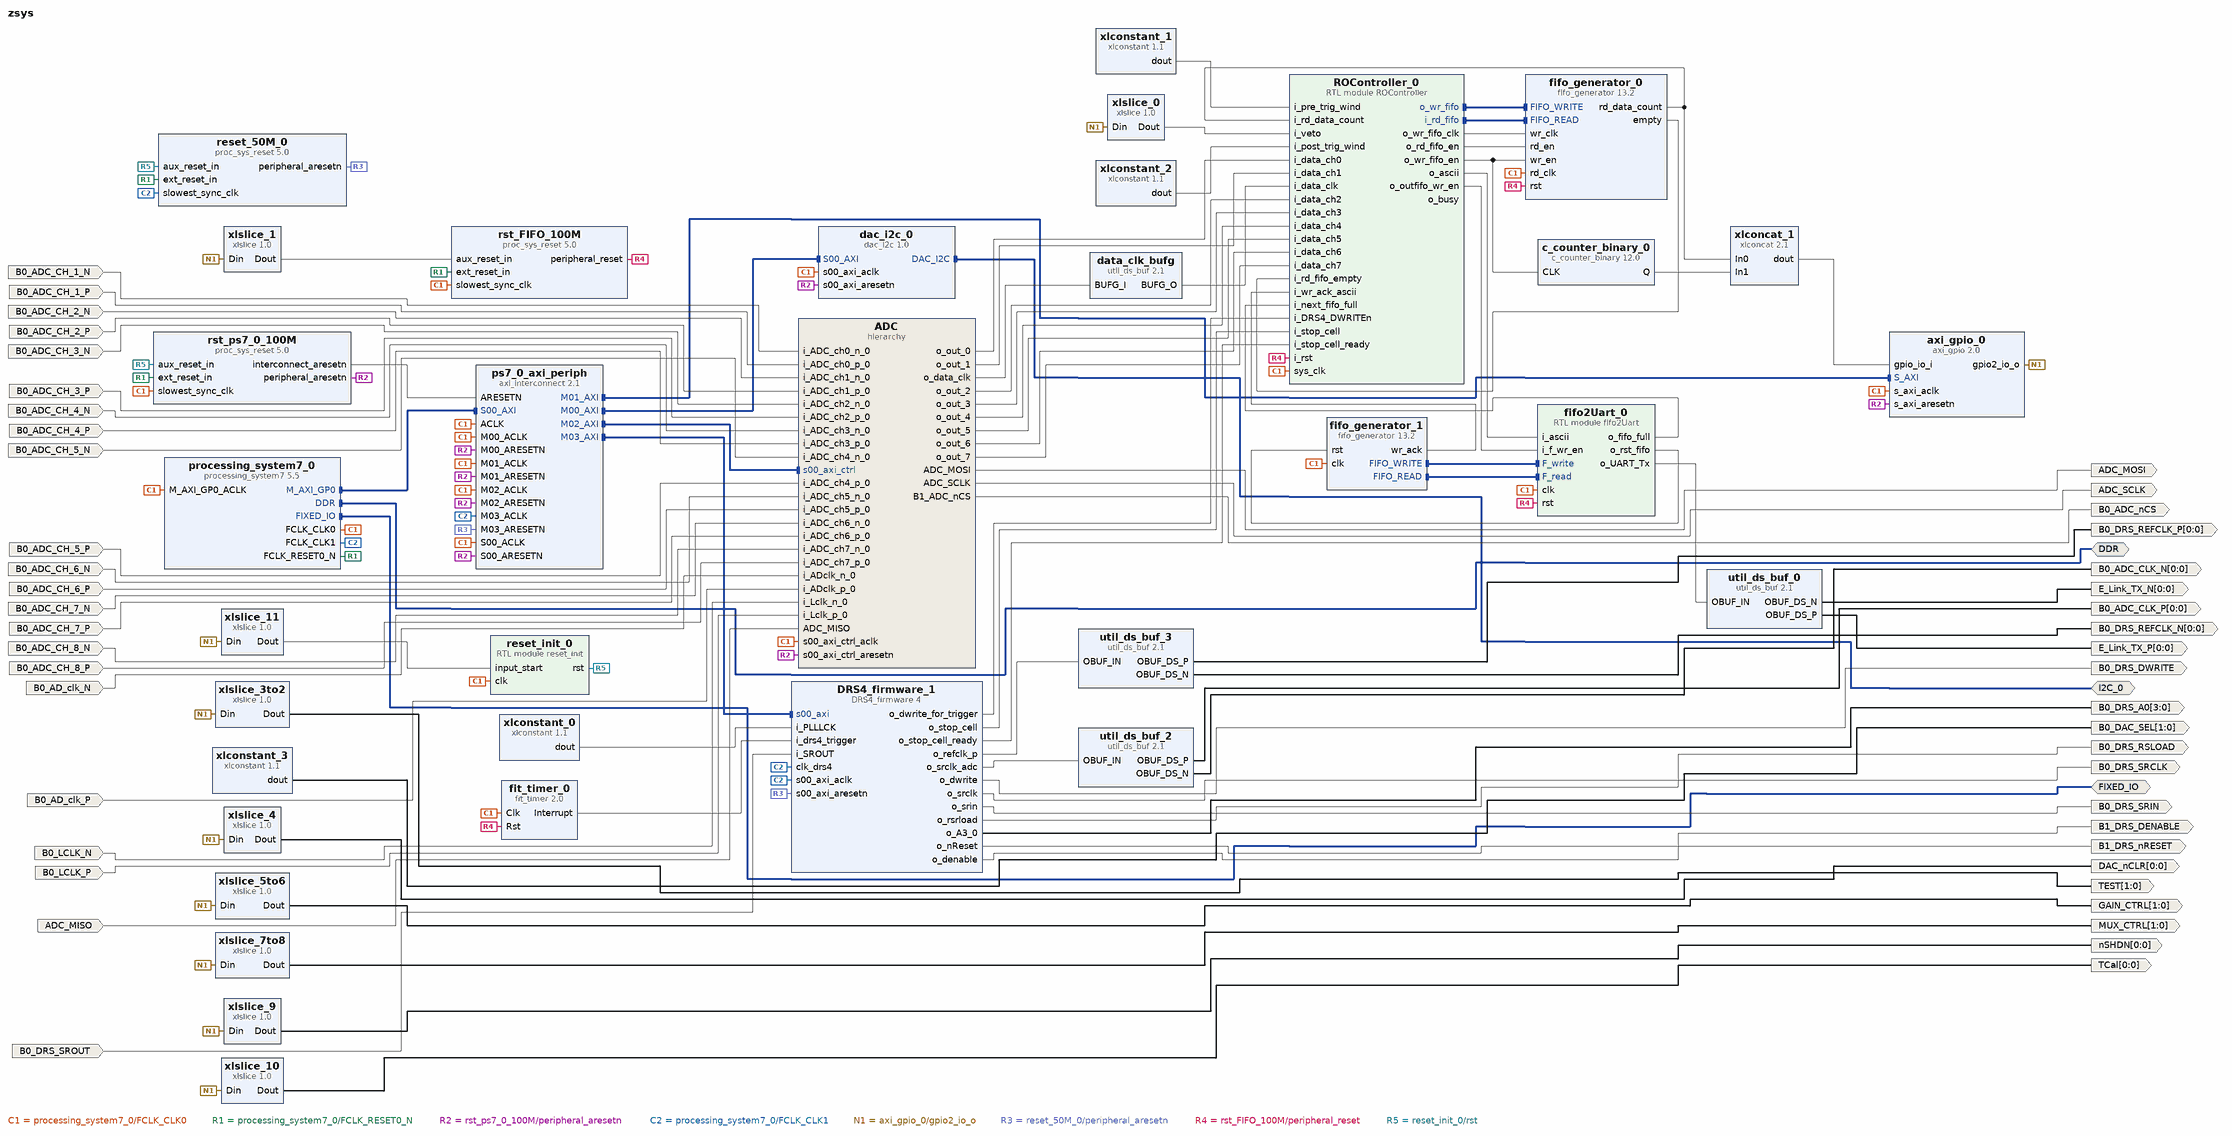
[diagram p0: block diagram of the top level]
# Vivado block design zsys, xc7z015clg485-1, Vivado 2018.2
create_bd_design zsys

create_bd_intf_port -mode Master -vlnv xilinx.com:interface:ddrx_rtl:1.0 DDR
create_bd_intf_port -mode Master -vlnv xilinx.com:display_processing_system7:fixedio_rtl:1.0 FIXED_IO
create_bd_intf_port -mode Master -vlnv xilinx.com:interface:iic_rtl:1.0 I2C_0
create_bd_port -dir I B0_ADC_CH_1_N
create_bd_port -dir I B0_ADC_CH_1_P
create_bd_port -dir I B0_ADC_CH_2_N
create_bd_port -dir I B0_ADC_CH_2_P
create_bd_port -dir I B0_ADC_CH_3_N
create_bd_port -dir I B0_ADC_CH_3_P
create_bd_port -dir I B0_ADC_CH_4_N
create_bd_port -dir I B0_ADC_CH_4_P
create_bd_port -dir I B0_ADC_CH_5_N
create_bd_port -dir I B0_ADC_CH_5_P
create_bd_port -dir I B0_ADC_CH_6_N
create_bd_port -dir I B0_ADC_CH_6_P
create_bd_port -dir I B0_ADC_CH_7_N
create_bd_port -dir I B0_ADC_CH_7_P
create_bd_port -dir I B0_ADC_CH_8_N
create_bd_port -dir I B0_ADC_CH_8_P
create_bd_port -dir I B0_AD_clk_N
create_bd_port -dir I B0_AD_clk_P
create_bd_port -dir I B0_LCLK_N
create_bd_port -dir I B0_LCLK_P
create_bd_port -dir I B0_DRS_SROUT
create_bd_port -dir I ADC_MISO
create_bd_port -dir O ADC_MOSI
create_bd_port -dir O ADC_SCLK
create_bd_port -dir O B0_ADC_nCS
create_bd_port -dir O -from 1 -to 0 TEST
create_bd_port -dir O -from 0 -to 0 -type clk B0_DRS_REFCLK_P
create_bd_port -dir O -from 0 -to 0 -type clk B0_DRS_REFCLK_N
create_bd_port -dir O -from 0 -to 0 -type clk B0_ADC_CLK_P
create_bd_port -dir O -from 0 -to 0 -type clk B0_ADC_CLK_N
create_bd_port -dir O B0_DRS_DWRITE
create_bd_port -dir O B0_DRS_SRCLK
create_bd_port -dir O B0_DRS_SRIN
create_bd_port -dir O B0_DRS_RSLOAD
create_bd_port -dir O -from 3 -to 0 B0_DRS_A0
create_bd_port -dir O B1_DRS_nRESET
create_bd_port -dir O B1_DRS_DENABLE
create_bd_port -dir O -from 1 -to 0 B0_DAC_SEL
create_bd_port -dir O -from 0 -to 0 DAC_nCLR
create_bd_port -dir O -from 1 -to 0 GAIN_CTRL
create_bd_port -dir O -from 1 -to 0 MUX_CTRL
create_bd_port -dir O -from 0 -to 0 nSHDN
create_bd_port -dir O -from 0 -to 0 TCal
create_bd_port -dir O -from 0 -to 0 E_Link_TX_P
create_bd_port -dir O -from 0 -to 0 E_Link_TX_N

create_bd_cell -type ip -vlnv xilinx.com:ip:processing_system7:5.5 processing_system7_0
set_property -dict [list \
  CONFIG.PCW_FCLK_CLK1_BUF TRUE \
  CONFIG.PCW_UIPARAM_DDR_FREQ_MHZ 533 \
  CONFIG.PCW_APU_PERIPHERAL_FREQMHZ 666 \
  CONFIG.PCW_UART_PERIPHERAL_FREQMHZ 100 \
  CONFIG.PCW_FPGA0_PERIPHERAL_FREQMHZ 100 \
  CONFIG.PCW_EN_CLK1_PORT 1 \
  CONFIG.PCW_PRESET_BANK0_VOLTAGE {LVCMOS 2.5V} \
  CONFIG.PCW_PRESET_BANK1_VOLTAGE {LVCMOS 1.8V} \
  CONFIG.PCW_UIPARAM_DDR_MEMORY_TYPE {DDR 3 (Low Voltage)} \
  CONFIG.PCW_UIPARAM_DDR_PARTNO {MT41J256M16 RE-125} \
  CONFIG.PCW_QSPI_PERIPHERAL_ENABLE 1 \
  CONFIG.PCW_QSPI_QSPI_IO {MIO 1 .. 6} \
  CONFIG.PCW_QSPI_GRP_SINGLE_SS_ENABLE 1 \
  CONFIG.PCW_QSPI_GRP_SINGLE_SS_IO {MIO 1 .. 6} \
  CONFIG.PCW_SINGLE_QSPI_DATA_MODE x4 \
  CONFIG.PCW_QSPI_GRP_FBCLK_ENABLE 1 \
  CONFIG.PCW_QSPI_GRP_FBCLK_IO {MIO 8} \
  CONFIG.PCW_ENET0_PERIPHERAL_ENABLE 1 \
  CONFIG.PCW_ENET0_ENET0_IO {MIO 16 .. 27} \
  CONFIG.PCW_ENET0_GRP_MDIO_ENABLE 1 \
  CONFIG.PCW_ENET0_GRP_MDIO_IO {MIO 52 .. 53} \
  CONFIG.PCW_ENET_RESET_ENABLE 1 \
  CONFIG.PCW_ENET_RESET_SELECT {Share reset pin} \
  CONFIG.PCW_ENET0_RESET_ENABLE 0 \
  CONFIG.PCW_ENET0_RESET_IO {MIO 50} \
  CONFIG.PCW_SD0_PERIPHERAL_ENABLE 0 \
  CONFIG.PCW_UART0_PERIPHERAL_ENABLE 1 \
  CONFIG.PCW_UART0_UART0_IO {MIO 14 .. 15} \
  CONFIG.PCW_USB0_PERIPHERAL_ENABLE 0 \
  CONFIG.PCW_USB_RESET_ENABLE 1 \
  CONFIG.PCW_I2C_RESET_ENABLE 0 \
  CONFIG.PCW_GPIO_MIO_GPIO_ENABLE 1 \
  CONFIG.PCW_GPIO_MIO_GPIO_IO MIO \
  CONFIG.PCW_FPGA_FCLK1_ENABLE 1 \
] [get_bd_cells processing_system7_0]
# 216 more settings of processing_system7_0 are not shown: defaults, MIO pin electricals, DDR timing, and values the tool derives
create_bd_cell -type hier ADC
create_bd_cell -type ip -vlnv xilinx.com:ip:proc_sys_reset:5.0 rst_ps7_0_100M
create_bd_cell -type ip -vlnv xilinx.com:ip:axi_interconnect:2.1 ps7_0_axi_periph
set_property -dict {CONFIG.NUM_MI 4} [get_bd_cells ps7_0_axi_periph]
create_bd_cell -type ip -vlnv xilinx.com:ip:fifo_generator:13.2 fifo_generator_0
set_property -dict [list \
  CONFIG.Fifo_Implementation Independent_Clocks_Block_RAM \
  CONFIG.Input_Data_Width 97 \
  CONFIG.Input_Depth 4096 \
  CONFIG.Output_Data_Width 97 \
  CONFIG.Full_Flags_Reset_Value 1 \
  CONFIG.Read_Data_Count true \
  CONFIG.Read_Data_Count_Width 12 \
  CONFIG.Enable_Safety_Circuit false \
] [get_bd_cells fifo_generator_0]
create_bd_cell -type ip -vlnv xilinx.com:ip:xlconstant:1.1 xlconstant_1
set_property -dict {CONFIG.CONST_WIDTH 12 CONFIG.CONST_VAL 100} [get_bd_cells xlconstant_1]
create_bd_cell -type ip -vlnv xilinx.com:ip:util_ds_buf:2.1 data_clk_bufg
set_property -dict {CONFIG.C_BUF_TYPE BUFG} [get_bd_cells data_clk_bufg]
create_bd_cell -type ip -vlnv xilinx.com:ip:proc_sys_reset:5.0 reset_50M_0
create_bd_cell -type ip -vlnv xilinx.com:ip:xlconstant:1.1 xlconstant_0
set_property -dict {CONFIG.CONST_VAL 0} [get_bd_cells xlconstant_0]
create_bd_cell -type ip -vlnv xilinx.com:ip:axi_gpio:2.0 axi_gpio_0
set_property -dict [list \
  CONFIG.C_GPIO_WIDTH 24 \
  CONFIG.C_GPIO2_WIDTH 12 \
  CONFIG.C_IS_DUAL 1 \
  CONFIG.C_ALL_INPUTS 1 \
  CONFIG.C_ALL_OUTPUTS_2 1 \
] [get_bd_cells axi_gpio_0]
create_bd_cell -type ip -vlnv xilinx.com:ip:xlconcat:2.1 xlconcat_1
set_property -dict {CONFIG.IN0_WIDTH 12 CONFIG.IN1_WIDTH 12} [get_bd_cells xlconcat_1]
create_bd_cell -type ip -vlnv xilinx.com:ip:xlslice:1.0 xlslice_0
set_property -dict {CONFIG.DIN_TO 0 CONFIG.DIN_FROM 0 CONFIG.DIN_WIDTH 12} [get_bd_cells xlslice_0]
create_bd_cell -type ip -vlnv xilinx.com:ip:xlslice:1.0 xlslice_1
set_property -dict {CONFIG.DIN_TO 1 CONFIG.DIN_FROM 1 CONFIG.DIN_WIDTH 12 CONFIG.DOUT_WIDTH 1} [get_bd_cells xlslice_1]
create_bd_cell -type ip -vlnv xilinx.com:ip:xlslice:1.0 xlslice_3to2
set_property -dict {CONFIG.DIN_TO 2 CONFIG.DIN_FROM 3 CONFIG.DIN_WIDTH 12 CONFIG.DOUT_WIDTH 2} [get_bd_cells xlslice_3to2]
create_bd_cell -type ip -vlnv xilinx.com:ip:xlslice:1.0 xlslice_4
set_property -dict {CONFIG.DIN_TO 4 CONFIG.DIN_FROM 4 CONFIG.DIN_WIDTH 12 CONFIG.DOUT_WIDTH 1} [get_bd_cells xlslice_4]
create_bd_cell -type ip -vlnv xilinx.com:ip:util_ds_buf:2.1 util_ds_buf_2
set_property -dict {CONFIG.C_BUF_TYPE OBUFDS} [get_bd_cells util_ds_buf_2]
create_bd_cell -type ip -vlnv xilinx.com:ip:util_ds_buf:2.1 util_ds_buf_3
set_property -dict {CONFIG.C_BUF_TYPE OBUFDS} [get_bd_cells util_ds_buf_3]
create_bd_cell -type ip -vlnv xilinx.com:ip:proc_sys_reset:5.0 rst_FIFO_100M
create_bd_cell -type ip -vlnv xilinx.com:ip:xlconstant:1.1 xlconstant_2
set_property -dict {CONFIG.CONST_WIDTH 12 CONFIG.CONST_VAL 1000} [get_bd_cells xlconstant_2]
create_bd_cell -type ip -vlnv xilinx.com:user:dac_i2c:1.0 dac_i2c_0
create_bd_cell -type ip -vlnv xilinx.com:ip:xlconstant:1.1 xlconstant_3
set_property -dict {CONFIG.CONST_WIDTH 2 CONFIG.CONST_VAL 2} [get_bd_cells xlconstant_3]
create_bd_cell -type ip -vlnv xilinx.com:user:DRS4_firmware:4 DRS4_firmware_1
create_bd_cell -type module -reference ROController ROController_0
create_bd_cell -type ip -vlnv xilinx.com:ip:fifo_generator:13.2 fifo_generator_1
set_property -dict [list \
  CONFIG.Fifo_Implementation Common_Clock_Builtin_FIFO \
  CONFIG.Input_Data_Width 8 \
  CONFIG.Input_Depth 512 \
  CONFIG.Write_Acknowledge_Flag true \
] [get_bd_cells fifo_generator_1]
create_bd_cell -type ip -vlnv xilinx.com:ip:c_counter_binary:12.0 c_counter_binary_0
set_property -dict {CONFIG.Output_Width 12} [get_bd_cells c_counter_binary_0]
create_bd_cell -type ip -vlnv xilinx.com:ip:fit_timer:2.0 fit_timer_0
set_property -dict {CONFIG.C_NO_CLOCKS 1500000000} [get_bd_cells fit_timer_0]
create_bd_cell -type ip -vlnv xilinx.com:ip:xlslice:1.0 xlslice_5to6
set_property -dict {CONFIG.DIN_TO 5 CONFIG.DIN_FROM 6 CONFIG.DIN_WIDTH 12 CONFIG.DOUT_WIDTH 2} [get_bd_cells xlslice_5to6]
create_bd_cell -type ip -vlnv xilinx.com:ip:xlslice:1.0 xlslice_7to8
set_property -dict {CONFIG.DIN_TO 7 CONFIG.DIN_FROM 8 CONFIG.DIN_WIDTH 12 CONFIG.DOUT_WIDTH 2} [get_bd_cells xlslice_7to8]
create_bd_cell -type ip -vlnv xilinx.com:ip:xlslice:1.0 xlslice_9
set_property -dict {CONFIG.DIN_TO 9 CONFIG.DIN_FROM 9 CONFIG.DIN_WIDTH 12 CONFIG.DOUT_WIDTH 1} [get_bd_cells xlslice_9]
create_bd_cell -type ip -vlnv xilinx.com:ip:xlslice:1.0 xlslice_10
set_property -dict {CONFIG.DIN_TO 10 CONFIG.DIN_FROM 10 CONFIG.DIN_WIDTH 12 CONFIG.DOUT_WIDTH 1} [get_bd_cells xlslice_10]
create_bd_cell -type ip -vlnv xilinx.com:ip:xlslice:1.0 xlslice_11
set_property -dict {CONFIG.DIN_TO 11 CONFIG.DIN_FROM 11 CONFIG.DIN_WIDTH 12 CONFIG.DOUT_WIDTH 1} [get_bd_cells xlslice_11]
create_bd_cell -type module -reference reset_init reset_init_0
create_bd_cell -type ip -vlnv xilinx.com:ip:util_ds_buf:2.1 util_ds_buf_0
set_property -dict {CONFIG.C_BUF_TYPE OBUFDS} [get_bd_cells util_ds_buf_0]
create_bd_cell -type module -reference fifo2Uart fifo2Uart_0
set_property -dict {CONFIG.baud_rate 115200} [get_bd_cells fifo2Uart_0]

# ---- hierarchy /ADC ----
current_bd_instance /ADC
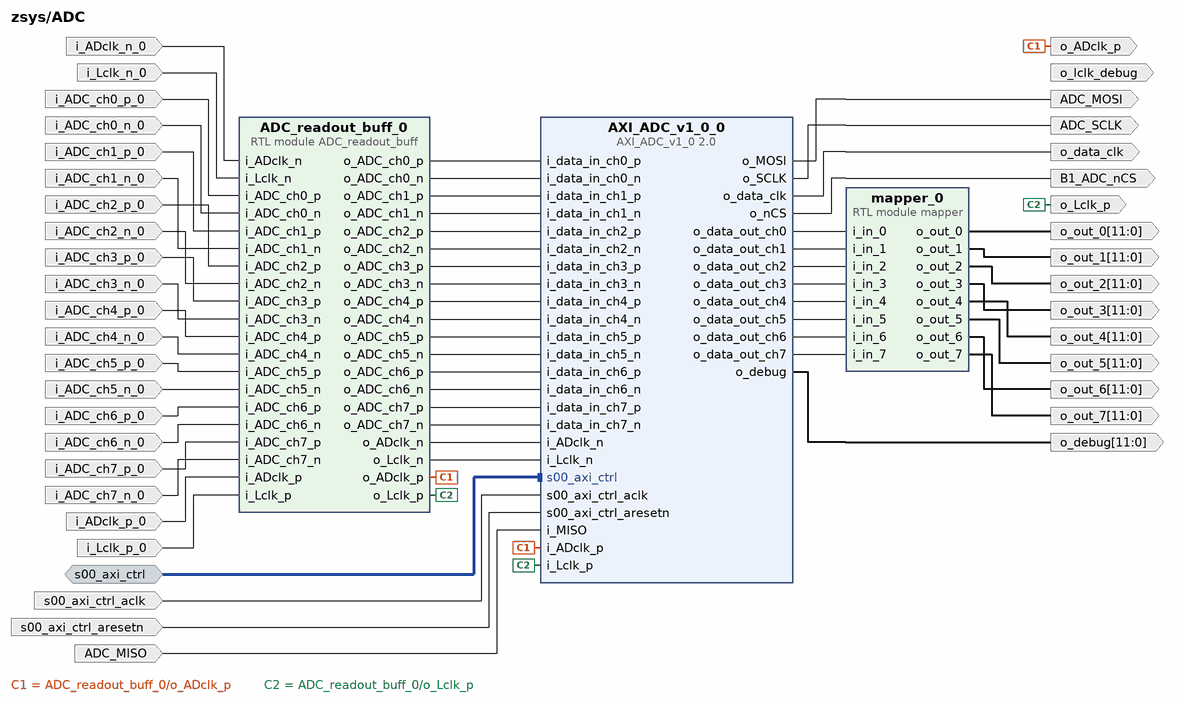
[diagram p1: block diagram inside /ADC]
create_bd_intf_pin -mode Slave -vlnv xilinx.com:interface:aximm_rtl:1.0 s00_axi_ctrl
create_bd_pin -dir I i_ADclk_p_0
create_bd_pin -dir I i_ADclk_n_0
create_bd_pin -dir I i_Lclk_p_0
create_bd_pin -dir I i_Lclk_n_0
create_bd_pin -dir I i_ADC_ch0_p_0
create_bd_pin -dir I i_ADC_ch0_n_0
create_bd_pin -dir I i_ADC_ch1_p_0
create_bd_pin -dir I i_ADC_ch1_n_0
create_bd_pin -dir I i_ADC_ch2_p_0
create_bd_pin -dir I i_ADC_ch2_n_0
create_bd_pin -dir I i_ADC_ch3_p_0
create_bd_pin -dir I i_ADC_ch3_n_0
create_bd_pin -dir I i_ADC_ch4_p_0
create_bd_pin -dir I i_ADC_ch4_n_0
create_bd_pin -dir I i_ADC_ch5_p_0
create_bd_pin -dir I i_ADC_ch5_n_0
create_bd_pin -dir I i_ADC_ch6_p_0
create_bd_pin -dir I i_ADC_ch6_n_0
create_bd_pin -dir I i_ADC_ch7_p_0
create_bd_pin -dir I i_ADC_ch7_n_0
create_bd_pin -dir O -from 11 -to 0 o_out_0
create_bd_pin -dir O -from 11 -to 0 o_out_1
create_bd_pin -dir O -from 11 -to 0 o_out_2
create_bd_pin -dir O -from 11 -to 0 o_out_3
create_bd_pin -dir O -from 11 -to 0 o_out_4
create_bd_pin -dir O -from 11 -to 0 o_out_5
create_bd_pin -dir O -from 11 -to 0 o_out_6
create_bd_pin -dir O -from 11 -to 0 o_out_7
create_bd_pin -dir I -type clk s00_axi_ctrl_aclk
create_bd_pin -dir I -type rst s00_axi_ctrl_aresetn
create_bd_pin -dir O -type clk o_data_clk
create_bd_pin -dir I ADC_MISO
create_bd_pin -dir O ADC_MOSI
create_bd_pin -dir O ADC_SCLK
create_bd_pin -dir O B1_ADC_nCS
create_bd_pin -dir O o_Lclk_p
create_bd_pin -dir O o_lclk_debug
create_bd_pin -dir O o_ADclk_p
create_bd_pin -dir O -from 11 -to 0 o_debug

create_bd_cell -type module -reference mapper mapper_0
create_bd_cell -type module -reference ADC_readout_buff ADC_readout_buff_0
create_bd_cell -type ip -vlnv xilinx.com:user:AXI_ADC_v1_0:2.0 AXI_ADC_v1_0_0

# ---- connections ----

current_bd_instance /ADC
connect_bd_intf_net [get_bd_intf_pins s00_axi_ctrl] [get_bd_intf_pins AXI_ADC_v1_0_0/s00_axi_ctrl]
connect_bd_net [get_bd_pins ADC_readout_buff_0/o_ADC_ch0_p] [get_bd_pins AXI_ADC_v1_0_0/i_data_in_ch0_p]
connect_bd_net [get_bd_pins ADC_readout_buff_0/o_ADC_ch0_n] [get_bd_pins AXI_ADC_v1_0_0/i_data_in_ch0_n]
connect_bd_net [get_bd_pins ADC_readout_buff_0/o_ADC_ch1_p] [get_bd_pins AXI_ADC_v1_0_0/i_data_in_ch1_p]
connect_bd_net [get_bd_pins ADC_readout_buff_0/o_ADC_ch1_n] [get_bd_pins AXI_ADC_v1_0_0/i_data_in_ch1_n]
connect_bd_net [get_bd_pins ADC_readout_buff_0/o_ADC_ch2_p] [get_bd_pins AXI_ADC_v1_0_0/i_data_in_ch2_p]
connect_bd_net [get_bd_pins ADC_readout_buff_0/o_ADC_ch2_n] [get_bd_pins AXI_ADC_v1_0_0/i_data_in_ch2_n]
connect_bd_net [get_bd_pins ADC_readout_buff_0/o_ADC_ch3_p] [get_bd_pins AXI_ADC_v1_0_0/i_data_in_ch3_p]
connect_bd_net [get_bd_pins ADC_readout_buff_0/o_ADC_ch3_n] [get_bd_pins AXI_ADC_v1_0_0/i_data_in_ch3_n]
connect_bd_net [get_bd_pins ADC_readout_buff_0/o_ADC_ch4_p] [get_bd_pins AXI_ADC_v1_0_0/i_data_in_ch4_p]
connect_bd_net [get_bd_pins ADC_readout_buff_0/o_ADC_ch4_n] [get_bd_pins AXI_ADC_v1_0_0/i_data_in_ch4_n]
connect_bd_net [get_bd_pins ADC_readout_buff_0/o_ADC_ch5_p] [get_bd_pins AXI_ADC_v1_0_0/i_data_in_ch5_p]
connect_bd_net [get_bd_pins ADC_readout_buff_0/o_ADC_ch5_n] [get_bd_pins AXI_ADC_v1_0_0/i_data_in_ch5_n]
connect_bd_net [get_bd_pins ADC_readout_buff_0/o_ADC_ch6_p] [get_bd_pins AXI_ADC_v1_0_0/i_data_in_ch6_p]
connect_bd_net [get_bd_pins ADC_readout_buff_0/o_ADC_ch6_n] [get_bd_pins AXI_ADC_v1_0_0/i_data_in_ch6_n]
connect_bd_net [get_bd_pins ADC_readout_buff_0/o_ADC_ch7_p] [get_bd_pins AXI_ADC_v1_0_0/i_data_in_ch7_p]
connect_bd_net [get_bd_pins ADC_readout_buff_0/o_ADC_ch7_n] [get_bd_pins AXI_ADC_v1_0_0/i_data_in_ch7_n]
connect_bd_net [get_bd_pins AXI_ADC_v1_0_0/o_data_out_ch0] [get_bd_pins mapper_0/i_in_0]
connect_bd_net [get_bd_pins AXI_ADC_v1_0_0/o_data_out_ch1] [get_bd_pins mapper_0/i_in_1]
connect_bd_net [get_bd_pins AXI_ADC_v1_0_0/o_data_out_ch2] [get_bd_pins mapper_0/i_in_2]
connect_bd_net [get_bd_pins AXI_ADC_v1_0_0/o_data_out_ch3] [get_bd_pins mapper_0/i_in_3]
connect_bd_net [get_bd_pins AXI_ADC_v1_0_0/o_data_out_ch4] [get_bd_pins mapper_0/i_in_4]
connect_bd_net [get_bd_pins AXI_ADC_v1_0_0/o_data_out_ch5] [get_bd_pins mapper_0/i_in_5]
connect_bd_net [get_bd_pins AXI_ADC_v1_0_0/o_data_out_ch6] [get_bd_pins mapper_0/i_in_6]
connect_bd_net [get_bd_pins AXI_ADC_v1_0_0/o_data_out_ch7] [get_bd_pins mapper_0/i_in_7]
connect_bd_net -net i_ADclk_n_0_1 [get_bd_pins i_ADclk_n_0] [get_bd_pins ADC_readout_buff_0/i_ADclk_n]
connect_bd_net -net i_Lclk_n_0_1 [get_bd_pins i_Lclk_n_0] [get_bd_pins ADC_readout_buff_0/i_Lclk_n]
connect_bd_net -net i_ADC_ch0_p_0_1 [get_bd_pins i_ADC_ch0_p_0] [get_bd_pins ADC_readout_buff_0/i_ADC_ch0_p]
connect_bd_net -net i_ADC_ch0_n_0_1 [get_bd_pins i_ADC_ch0_n_0] [get_bd_pins ADC_readout_buff_0/i_ADC_ch0_n]
connect_bd_net -net i_ADC_ch1_p_0_1 [get_bd_pins i_ADC_ch1_p_0] [get_bd_pins ADC_readout_buff_0/i_ADC_ch1_p]
connect_bd_net -net i_ADC_ch1_n_0_1 [get_bd_pins i_ADC_ch1_n_0] [get_bd_pins ADC_readout_buff_0/i_ADC_ch1_n]
connect_bd_net -net i_ADC_ch2_p_0_1 [get_bd_pins i_ADC_ch2_p_0] [get_bd_pins ADC_readout_buff_0/i_ADC_ch2_p]
connect_bd_net -net i_ADC_ch2_n_0_1 [get_bd_pins i_ADC_ch2_n_0] [get_bd_pins ADC_readout_buff_0/i_ADC_ch2_n]
connect_bd_net -net i_ADC_ch3_p_0_1 [get_bd_pins i_ADC_ch3_p_0] [get_bd_pins ADC_readout_buff_0/i_ADC_ch3_p]
connect_bd_net -net i_ADC_ch3_n_0_1 [get_bd_pins i_ADC_ch3_n_0] [get_bd_pins ADC_readout_buff_0/i_ADC_ch3_n]
connect_bd_net -net i_ADC_ch4_p_0_1 [get_bd_pins i_ADC_ch4_p_0] [get_bd_pins ADC_readout_buff_0/i_ADC_ch4_p]
connect_bd_net -net i_ADC_ch4_n_0_1 [get_bd_pins i_ADC_ch4_n_0] [get_bd_pins ADC_readout_buff_0/i_ADC_ch4_n]
connect_bd_net -net i_ADC_ch5_p_0_1 [get_bd_pins i_ADC_ch5_p_0] [get_bd_pins ADC_readout_buff_0/i_ADC_ch5_p]
connect_bd_net -net i_ADC_ch5_n_0_1 [get_bd_pins i_ADC_ch5_n_0] [get_bd_pins ADC_readout_buff_0/i_ADC_ch5_n]
connect_bd_net -net i_ADC_ch6_p_0_1 [get_bd_pins i_ADC_ch6_p_0] [get_bd_pins ADC_readout_buff_0/i_ADC_ch6_p]
connect_bd_net -net i_ADC_ch6_n_0_1 [get_bd_pins i_ADC_ch6_n_0] [get_bd_pins ADC_readout_buff_0/i_ADC_ch6_n]
connect_bd_net -net i_ADC_ch7_p_0_1 [get_bd_pins i_ADC_ch7_p_0] [get_bd_pins ADC_readout_buff_0/i_ADC_ch7_p]
connect_bd_net -net i_ADC_ch7_n_0_1 [get_bd_pins i_ADC_ch7_n_0] [get_bd_pins ADC_readout_buff_0/i_ADC_ch7_n]
connect_bd_net [get_bd_pins mapper_0/o_out_0] [get_bd_pins o_out_0]
connect_bd_net [get_bd_pins mapper_0/o_out_1] [get_bd_pins o_out_1]
connect_bd_net [get_bd_pins mapper_0/o_out_2] [get_bd_pins o_out_2]
connect_bd_net [get_bd_pins mapper_0/o_out_3] [get_bd_pins o_out_3]
connect_bd_net [get_bd_pins mapper_0/o_out_4] [get_bd_pins o_out_4]
connect_bd_net [get_bd_pins mapper_0/o_out_5] [get_bd_pins o_out_5]
connect_bd_net [get_bd_pins mapper_0/o_out_6] [get_bd_pins o_out_6]
connect_bd_net [get_bd_pins mapper_0/o_out_7] [get_bd_pins o_out_7]
connect_bd_net [get_bd_pins s00_axi_ctrl_aclk] [get_bd_pins AXI_ADC_v1_0_0/s00_axi_ctrl_aclk]
connect_bd_net [get_bd_pins s00_axi_ctrl_aresetn] [get_bd_pins AXI_ADC_v1_0_0/s00_axi_ctrl_aresetn]
connect_bd_net [get_bd_pins AXI_ADC_v1_0_0/o_data_clk] [get_bd_pins o_data_clk]
connect_bd_net [get_bd_pins ADC_MISO] [get_bd_pins AXI_ADC_v1_0_0/i_MISO]
connect_bd_net [get_bd_pins AXI_ADC_v1_0_0/o_MOSI] [get_bd_pins ADC_MOSI]
connect_bd_net [get_bd_pins AXI_ADC_v1_0_0/o_SCLK] [get_bd_pins ADC_SCLK]
connect_bd_net [get_bd_pins AXI_ADC_v1_0_0/o_nCS] [get_bd_pins B1_ADC_nCS]
# net AXI_ADC_v1_0_0_o_lclk_debug has one end: o_lclk_debug
connect_bd_net [get_bd_pins ADC_readout_buff_0/o_ADclk_p] [get_bd_pins o_ADclk_p] [get_bd_pins AXI_ADC_v1_0_0/i_ADclk_p]
connect_bd_net [get_bd_pins ADC_readout_buff_0/o_ADclk_n] [get_bd_pins AXI_ADC_v1_0_0/i_ADclk_n]
connect_bd_net [get_bd_pins ADC_readout_buff_0/o_Lclk_p] [get_bd_pins o_Lclk_p] [get_bd_pins AXI_ADC_v1_0_0/i_Lclk_p]
connect_bd_net [get_bd_pins ADC_readout_buff_0/o_Lclk_n] [get_bd_pins AXI_ADC_v1_0_0/i_Lclk_n]
connect_bd_net -net i_ADclk_p_0_1 [get_bd_pins i_ADclk_p_0] [get_bd_pins ADC_readout_buff_0/i_ADclk_p]
connect_bd_net -net i_Lclk_p_0_1 [get_bd_pins i_Lclk_p_0] [get_bd_pins ADC_readout_buff_0/i_Lclk_p]
connect_bd_net [get_bd_pins AXI_ADC_v1_0_0/o_debug] [get_bd_pins o_debug]

current_bd_instance /
connect_bd_intf_net [get_bd_intf_pins processing_system7_0/M_AXI_GP0] [get_bd_intf_pins ps7_0_axi_periph/S00_AXI]
connect_bd_intf_net [get_bd_intf_pins ps7_0_axi_periph/M02_AXI] [get_bd_intf_pins ADC/s00_axi_ctrl]
connect_bd_intf_net [get_bd_intf_pins ROController_0/o_wr_fifo] [get_bd_intf_pins fifo_generator_0/FIFO_WRITE]
connect_bd_intf_net [get_bd_intf_pins ROController_0/i_rd_fifo] [get_bd_intf_pins fifo_generator_0/FIFO_READ]
connect_bd_intf_net [get_bd_intf_pins ps7_0_axi_periph/M00_AXI] [get_bd_intf_pins dac_i2c_0/S00_AXI]
connect_bd_intf_net [get_bd_intf_pins fifo_generator_1/FIFO_WRITE] [get_bd_intf_pins fifo2Uart_0/F_write]
connect_bd_intf_net [get_bd_intf_pins fifo_generator_1/FIFO_READ] [get_bd_intf_pins fifo2Uart_0/F_read]
connect_bd_intf_net [get_bd_intf_pins ps7_0_axi_periph/M01_AXI] [get_bd_intf_pins axi_gpio_0/S_AXI]
connect_bd_intf_net [get_bd_intf_pins ps7_0_axi_periph/M03_AXI] [get_bd_intf_pins DRS4_firmware_1/s00_axi]
connect_bd_intf_net [get_bd_intf_ports DDR] [get_bd_intf_pins processing_system7_0/DDR]
connect_bd_intf_net [get_bd_intf_ports FIXED_IO] [get_bd_intf_pins processing_system7_0/FIXED_IO]
connect_bd_intf_net [get_bd_intf_ports I2C_0] [get_bd_intf_pins dac_i2c_0/DAC_I2C]
connect_bd_net [get_bd_pins processing_system7_0/FCLK_CLK0] \
  [get_bd_pins processing_system7_0/M_AXI_GP0_ACLK] [get_bd_pins rst_ps7_0_100M/slowest_sync_clk] \
  [get_bd_pins fifo_generator_0/rd_clk] [get_bd_pins axi_gpio_0/s_axi_aclk] [get_bd_pins rst_FIFO_100M/slowest_sync_clk] \
  [get_bd_pins dac_i2c_0/s00_axi_aclk] [get_bd_pins ROController_0/sys_clk] [get_bd_pins fifo_generator_1/clk] \
  [get_bd_pins fit_timer_0/Clk] [get_bd_pins reset_init_0/clk] [get_bd_pins ps7_0_axi_periph/S00_ACLK] \
  [get_bd_pins ps7_0_axi_periph/M00_ACLK] [get_bd_pins ps7_0_axi_periph/ACLK] [get_bd_pins ps7_0_axi_periph/M01_ACLK] \
  [get_bd_pins ADC/s00_axi_ctrl_aclk] [get_bd_pins ps7_0_axi_periph/M02_ACLK] [get_bd_pins fifo2Uart_0/clk]
connect_bd_net -net i_ADC_ch0_n_0_1 [get_bd_ports B0_ADC_CH_1_N] [get_bd_pins ADC/i_ADC_ch0_n_0]
connect_bd_net -net i_ADC_ch0_p_0_1 [get_bd_ports B0_ADC_CH_1_P] [get_bd_pins ADC/i_ADC_ch0_p_0]
connect_bd_net -net i_ADC_ch1_n_0_1 [get_bd_ports B0_ADC_CH_2_N] [get_bd_pins ADC/i_ADC_ch1_n_0]
connect_bd_net -net i_ADC_ch1_p_0_1 [get_bd_ports B0_ADC_CH_2_P] [get_bd_pins ADC/i_ADC_ch1_p_0]
connect_bd_net -net i_ADC_ch2_n_0_1 [get_bd_ports B0_ADC_CH_3_N] [get_bd_pins ADC/i_ADC_ch2_n_0]
connect_bd_net -net i_ADC_ch2_p_0_1 [get_bd_ports B0_ADC_CH_3_P] [get_bd_pins ADC/i_ADC_ch2_p_0]
connect_bd_net -net i_ADC_ch3_n_0_1 [get_bd_ports B0_ADC_CH_4_N] [get_bd_pins ADC/i_ADC_ch3_n_0]
connect_bd_net -net i_ADC_ch3_p_0_1 [get_bd_ports B0_ADC_CH_4_P] [get_bd_pins ADC/i_ADC_ch3_p_0]
connect_bd_net -net i_ADC_ch4_n_0_1 [get_bd_ports B0_ADC_CH_5_N] [get_bd_pins ADC/i_ADC_ch4_n_0]
connect_bd_net -net i_ADC_ch4_p_0_1 [get_bd_ports B0_ADC_CH_5_P] [get_bd_pins ADC/i_ADC_ch4_p_0]
connect_bd_net -net i_ADC_ch5_n_0_1 [get_bd_ports B0_ADC_CH_6_N] [get_bd_pins ADC/i_ADC_ch5_n_0]
connect_bd_net -net i_ADC_ch5_p_0_1 [get_bd_ports B0_ADC_CH_6_P] [get_bd_pins ADC/i_ADC_ch5_p_0]
connect_bd_net -net i_ADC_ch6_n_0_1 [get_bd_ports B0_ADC_CH_7_N] [get_bd_pins ADC/i_ADC_ch6_n_0]
connect_bd_net -net i_ADC_ch6_p_0_1 [get_bd_ports B0_ADC_CH_7_P] [get_bd_pins ADC/i_ADC_ch6_p_0]
connect_bd_net -net i_ADC_ch7_n_0_1 [get_bd_ports B0_ADC_CH_8_N] [get_bd_pins ADC/i_ADC_ch7_n_0]
connect_bd_net -net i_ADC_ch7_p_0_1 [get_bd_ports B0_ADC_CH_8_P] [get_bd_pins ADC/i_ADC_ch7_p_0]
connect_bd_net -net i_ADclk_n_0_1 [get_bd_ports B0_AD_clk_N] [get_bd_pins ADC/i_ADclk_n_0]
connect_bd_net -net i_ADclk_p_0_1 [get_bd_ports B0_AD_clk_P] [get_bd_pins ADC/i_ADclk_p_0]
connect_bd_net -net i_Lclk_n_0_1 [get_bd_ports B0_LCLK_N] [get_bd_pins ADC/i_Lclk_n_0]
connect_bd_net -net i_Lclk_p_0_1 [get_bd_ports B0_LCLK_P] [get_bd_pins ADC/i_Lclk_p_0]
connect_bd_net [get_bd_pins ADC/o_out_0] [get_bd_pins ROController_0/i_data_ch0]
connect_bd_net [get_bd_pins ADC/o_out_1] [get_bd_pins ROController_0/i_data_ch1]
connect_bd_net [get_bd_pins ADC/o_out_2] [get_bd_pins ROController_0/i_data_ch2]
connect_bd_net [get_bd_pins ADC/o_out_3] [get_bd_pins ROController_0/i_data_ch3]
connect_bd_net [get_bd_pins ADC/o_out_4] [get_bd_pins ROController_0/i_data_ch4]
connect_bd_net [get_bd_pins ADC/o_out_5] [get_bd_pins ROController_0/i_data_ch5]
connect_bd_net [get_bd_pins ADC/o_out_6] [get_bd_pins ROController_0/i_data_ch6]
connect_bd_net [get_bd_pins ADC/o_out_7] [get_bd_pins ROController_0/i_data_ch7]
connect_bd_net [get_bd_pins processing_system7_0/FCLK_RESET0_N] \
  [get_bd_pins rst_ps7_0_100M/ext_reset_in] [get_bd_pins reset_50M_0/ext_reset_in] [get_bd_pins rst_FIFO_100M/ext_reset_in]
connect_bd_net [get_bd_pins rst_ps7_0_100M/peripheral_aresetn] \
  [get_bd_pins axi_gpio_0/s_axi_aresetn] [get_bd_pins dac_i2c_0/s00_axi_aresetn] [get_bd_pins ps7_0_axi_periph/S00_ARESETN] \
  [get_bd_pins ps7_0_axi_periph/M00_ARESETN] [get_bd_pins ps7_0_axi_periph/M01_ARESETN] \
  [get_bd_pins ADC/s00_axi_ctrl_aresetn] [get_bd_pins ps7_0_axi_periph/M02_ARESETN]
connect_bd_net [get_bd_pins rst_ps7_0_100M/interconnect_aresetn] [get_bd_pins ps7_0_axi_periph/ARESETN]
connect_bd_net [get_bd_pins ROController_0/o_wr_fifo_clk] [get_bd_pins fifo_generator_0/wr_clk]
connect_bd_net [get_bd_pins fifo_generator_0/rd_data_count] [get_bd_pins xlconcat_1/In0] [get_bd_pins ROController_0/i_rd_data_count]
connect_bd_net [get_bd_pins xlconstant_1/dout] [get_bd_pins ROController_0/i_pre_trig_wind]
connect_bd_net -net util_ds_buf_0_BUFG_O [get_bd_pins data_clk_bufg/BUFG_O] [get_bd_pins ROController_0/i_data_clk]
connect_bd_net [get_bd_pins ROController_0/o_ascii] [get_bd_pins fifo2Uart_0/i_ascii]
connect_bd_net [get_bd_pins ROController_0/o_outfifo_wr_en] [get_bd_pins fifo2Uart_0/i_f_wr_en]
# net ROController_0_o_busy has one end: ROController_0/o_busy
connect_bd_net [get_bd_pins processing_system7_0/FCLK_CLK1] \
  [get_bd_pins reset_50M_0/slowest_sync_clk] [get_bd_pins DRS4_firmware_1/clk_drs4] \
  [get_bd_pins DRS4_firmware_1/s00_axi_aclk] [get_bd_pins ps7_0_axi_periph/M03_ACLK]
connect_bd_net -net i_SROUT_0_1 [get_bd_ports B0_DRS_SROUT] [get_bd_pins DRS4_firmware_1/i_SROUT]
connect_bd_net [get_bd_ports ADC_MISO] [get_bd_pins ADC/ADC_MISO]
connect_bd_net [get_bd_pins ADC/ADC_MOSI] [get_bd_ports ADC_MOSI]
connect_bd_net [get_bd_pins ADC/ADC_SCLK] [get_bd_ports ADC_SCLK]
connect_bd_net [get_bd_pins ADC/B1_ADC_nCS] [get_bd_ports B0_ADC_nCS]
connect_bd_net -net DRS4_firmware_0_o_dwrite_for_trigger [get_bd_pins DRS4_firmware_1/o_dwrite_for_trigger] \
  [get_bd_pins ROController_0/i_DRS4_DWRITEn]
connect_bd_net [get_bd_pins xlconstant_0/dout] [get_bd_pins DRS4_firmware_1/i_PLLLCK]
connect_bd_net [get_bd_pins xlconcat_1/dout] [get_bd_pins axi_gpio_0/gpio_io_i]
connect_bd_net [get_bd_pins axi_gpio_0/gpio2_io_o] \
  [get_bd_pins xlslice_0/Din] [get_bd_pins xlslice_1/Din] [get_bd_pins xlslice_3to2/Din] [get_bd_pins xlslice_4/Din] \
  [get_bd_pins xlslice_5to6/Din] [get_bd_pins xlslice_7to8/Din] [get_bd_pins xlslice_9/Din] [get_bd_pins xlslice_10/Din] \
  [get_bd_pins xlslice_11/Din]
connect_bd_net -net xlslice_1_Dout [get_bd_pins xlslice_0/Dout] [get_bd_pins ROController_0/i_veto]
connect_bd_net -net xlslice_2_Dout [get_bd_pins xlslice_1/Dout] [get_bd_pins rst_FIFO_100M/aux_reset_in]
connect_bd_net -net xlslice_3_Dout [get_bd_pins xlslice_3to2/Dout] [get_bd_ports TEST]
connect_bd_net [get_bd_pins util_ds_buf_3/OBUF_DS_P] [get_bd_ports B0_DRS_REFCLK_P]
connect_bd_net [get_bd_pins util_ds_buf_3/OBUF_DS_N] [get_bd_ports B0_DRS_REFCLK_N]
connect_bd_net [get_bd_pins util_ds_buf_2/OBUF_DS_P] [get_bd_ports B0_ADC_CLK_P]
connect_bd_net [get_bd_pins util_ds_buf_2/OBUF_DS_N] [get_bd_ports B0_ADC_CLK_N]
connect_bd_net -net DRS4_firmware_0_o_srclk_R2 [get_bd_pins DRS4_firmware_1/o_srclk_adc] [get_bd_pins util_ds_buf_2/OBUF_IN]
connect_bd_net [get_bd_pins reset_50M_0/peripheral_aresetn] [get_bd_pins DRS4_firmware_1/s00_axi_aresetn] [get_bd_pins ps7_0_axi_periph/M03_ARESETN]
connect_bd_net [get_bd_pins DRS4_firmware_1/o_dwrite] [get_bd_ports B0_DRS_DWRITE]
connect_bd_net [get_bd_pins DRS4_firmware_1/o_refclk_p] [get_bd_pins util_ds_buf_3/OBUF_IN]
connect_bd_net [get_bd_pins DRS4_firmware_1/o_srclk] [get_bd_ports B0_DRS_SRCLK]
connect_bd_net [get_bd_pins DRS4_firmware_1/o_srin] [get_bd_ports B0_DRS_SRIN]
connect_bd_net [get_bd_pins DRS4_firmware_1/o_rsrload] [get_bd_ports B0_DRS_RSLOAD]
connect_bd_net [get_bd_pins DRS4_firmware_1/o_A3_0] [get_bd_ports B0_DRS_A0]
connect_bd_net [get_bd_pins DRS4_firmware_1/o_stop_cell] [get_bd_pins ROController_0/i_stop_cell]
connect_bd_net [get_bd_pins rst_FIFO_100M/peripheral_reset] \
  [get_bd_pins fifo_generator_0/rst] [get_bd_pins ROController_0/i_rst] [get_bd_pins fit_timer_0/Rst] \
  [get_bd_pins fifo2Uart_0/rst]
connect_bd_net [get_bd_pins xlconstant_2/dout] [get_bd_pins ROController_0/i_post_trig_wind]
connect_bd_net [get_bd_pins ADC/o_data_clk] [get_bd_pins data_clk_bufg/BUFG_I]
connect_bd_net [get_bd_pins DRS4_firmware_1/o_nReset] [get_bd_ports B1_DRS_nRESET]
connect_bd_net [get_bd_pins DRS4_firmware_1/o_denable] [get_bd_ports B1_DRS_DENABLE]
connect_bd_net [get_bd_pins DRS4_firmware_1/o_stop_cell_ready] [get_bd_pins ROController_0/i_stop_cell_ready]
connect_bd_net [get_bd_pins xlconstant_3/dout] [get_bd_ports B0_DAC_SEL]
connect_bd_net -net xlslice_5to4_Dout [get_bd_pins xlslice_4/Dout] [get_bd_ports DAC_nCLR]
connect_bd_net [get_bd_pins fifo2Uart_0/o_fifo_full] [get_bd_pins ROController_0/i_next_fifo_full]
connect_bd_net [get_bd_pins fifo_generator_1/wr_ack] [get_bd_pins ROController_0/i_wr_ack_ascii]
connect_bd_net [get_bd_pins fifo2Uart_0/o_rst_fifo] [get_bd_pins fifo_generator_1/rst]
connect_bd_net [get_bd_pins c_counter_binary_0/Q] [get_bd_pins xlconcat_1/In1]
connect_bd_net [get_bd_pins ROController_0/o_rd_fifo_en] [get_bd_pins fifo_generator_0/rd_en]
connect_bd_net [get_bd_pins fifo_generator_0/empty] [get_bd_pins ROController_0/i_rd_fifo_empty]
connect_bd_net [get_bd_pins ROController_0/o_wr_fifo_en] [get_bd_pins fifo_generator_0/wr_en] [get_bd_pins c_counter_binary_0/CLK]
connect_bd_net [get_bd_pins fit_timer_0/Interrupt] [get_bd_pins DRS4_firmware_1/i_drs4_trigger]
connect_bd_net -net xlslice_2_Dout1 [get_bd_pins xlslice_5to6/Dout] [get_bd_ports GAIN_CTRL]
connect_bd_net -net xlslice_5to7_Dout [get_bd_pins xlslice_7to8/Dout] [get_bd_ports MUX_CTRL]
connect_bd_net -net xlslice_7to9_Dout [get_bd_pins xlslice_9/Dout] [get_bd_ports nSHDN]
connect_bd_net -net xlslice_7to10_Dout [get_bd_pins xlslice_10/Dout] [get_bd_ports TCal]
connect_bd_net [get_bd_pins xlslice_11/Dout] [get_bd_pins reset_init_0/input_start]
connect_bd_net [get_bd_pins reset_init_0/rst] [get_bd_pins reset_50M_0/aux_reset_in] [get_bd_pins rst_ps7_0_100M/aux_reset_in]
connect_bd_net [get_bd_pins fifo2Uart_0/o_UART_Tx] [get_bd_pins util_ds_buf_0/OBUF_IN]
connect_bd_net [get_bd_pins util_ds_buf_0/OBUF_DS_P] [get_bd_ports E_Link_TX_P]
connect_bd_net [get_bd_pins util_ds_buf_0/OBUF_DS_N] [get_bd_ports E_Link_TX_N]

# ---- address map ----
assign_bd_address -offset 0x41200000 -range 64K -target_address_space [get_bd_addr_spaces processing_system7_0/Data] [get_bd_addr_segs axi_gpio_0/S_AXI/Reg]
assign_bd_address -offset 0x43C00000 -range 64K -target_address_space [get_bd_addr_spaces processing_system7_0/Data] [get_bd_addr_segs dac_i2c_0/S00_AXI/S00_AXI_reg]
assign_bd_address -offset 0x43C10000 -range 64K -target_address_space [get_bd_addr_spaces processing_system7_0/Data] [get_bd_addr_segs ADC/AXI_ADC_v1_0_0/s00_axi_ctrl/reg0]
assign_bd_address -offset 0x43C20000 -range 64K -target_address_space [get_bd_addr_spaces processing_system7_0/Data] [get_bd_addr_segs DRS4_firmware_1/s00_axi/reg0]

validate_bd_design
save_bd_design
